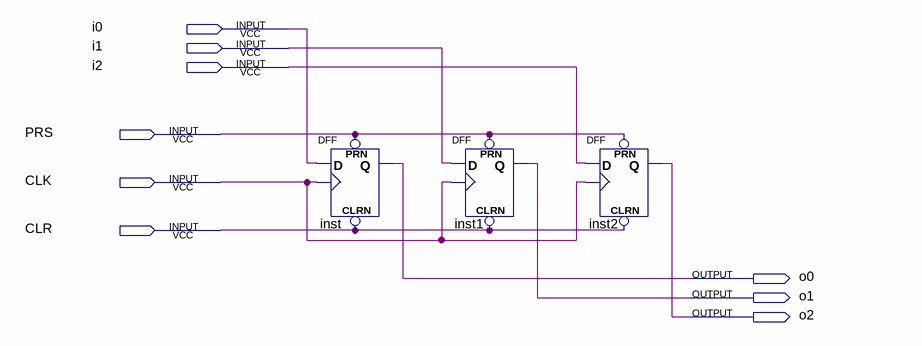
[diagram p0: schematic sheet]
// Quartus schematic data_3bits_register.bdf as structural Verilog: 3 symbols, 9 pins
module data_3bits_register (
  input  i0,
  input  i1,
  input  i2,
  input  PRS,
  input  CLK,
  input  CLR,
  output o0,
  output o1,
  output o2
);

  DFF inst (.CLRN(CLR), .CLK(CLK), .D(i0), .PRN(PRS), .Q(o0));
  DFF inst1 (.CLRN(CLR), .CLK(CLK), .D(i1), .PRN(PRS), .Q(o1));
  DFF inst2 (.CLRN(CLR), .CLK(CLK), .D(i2), .PRN(PRS), .Q(o2));
endmodule
